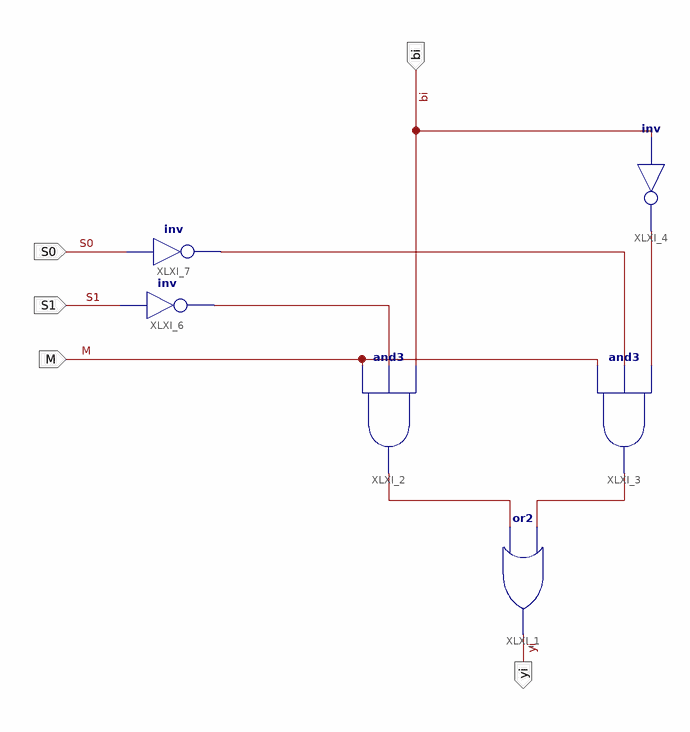
[diagram p0: schematic sheet 1]
// Xilinx ISE schematic arith_ext.sch (spartan3e) as structural Verilog: 6 symbols, 5 ports
module arith_ext (
  input  S0,
  input  S1,
  input  bi,
  input  M,
  output yi
);

  wire XLXN_2, XLXN_3, XLXN_4, XLXN_7, XLXN_12;

  or XLXI_1 (yi, XLXN_2, XLXN_3);
  and XLXI_2 (XLXN_2, M, XLXN_7, bi);
  and XLXI_3 (XLXN_3, M, XLXN_4, XLXN_12);
  not XLXI_4 (XLXN_12, bi);
  not XLXI_6 (XLXN_7, S1);
  not XLXI_7 (XLXN_4, S0);
endmodule
